# Altium schematic sheet 低电压关断_MAX931.SchDoc
size A4; DocumentNumber: 3; SheetNumber: 3; SheetTotal: 34
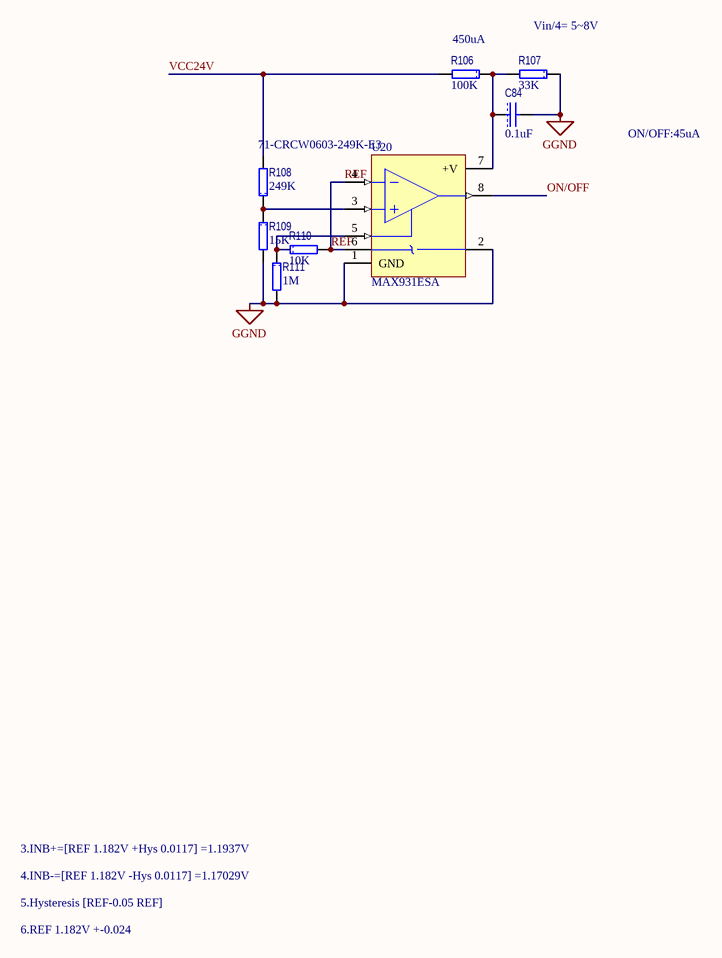
[diagram p0: 低电压关断_MAX931.SchDoc]

## Parts
C84  value 0.1uF  [1608[0603]C]  (hidden comment: C1608X7R1H104K)
R106  value 100K  [1608[0603]R]  (hidden comment: CRCW0603100KFKEA)
R107  value 33K  [1608[0603]R]  (hidden comment: CRCW060333K0FKEA)
R108  value 249K  Supplier Part Number 1: 71-CRCW0603-249K-E3  [1608[0603]R]  (hidden comment: CRCW0603249KFKEA)
R109  value 15K  [1608[0603]R]  (hidden comment: CRCW060315K0FKEA)
R110  value 10K  [1608[0603]R]  (hidden comment: CRCW060310K0FKEA)
R111  value 1M  [1608[0603]R]  (hidden comment: CRCW060310K0FKEA)
U20  MAX931ESA  [NSO8_N]

## Nets
GGND: C84.2 R107.1 R109.2 R111.2 U20.1(GND) U20.2(-V)
ON/OFF: U20.8(OUT)
REF: R110.2 U20.4(IN-) U20.6(REF)
VCC24V: R106.2 R108.2
NetC84_1: C84.1 R106.1 R107.2 U20.7(+V)
NetR108_1: R108.1 R109.1 U20.3(IN+)
NetR110_1: R110.1 R111.1 U20.5(HYST)

## Notes on the sheet
- (near R106) 450uA
- (near R107) Vin/4= 5~8V
- ON/OFF:45uA
- 4.INB-=[REF 1.182V -Hys 0.0117] =1.17029V
- 3.INB+=[REF 1.182V +Hys 0.0117] =1.1937V
- 6.REF 1.182V +-0.024
- 5.Hysteresis [REF-0.05 REF]

## Library data of the parts
C84 = CAP: 多层陶瓷电容器MLCC - SMD/SMT 0603 0.1uF 50volts X7R 10%; Manufacturer: TDK; 尺寸: 0.8 mm W x 1.6 mm L x 0.8 mm H; 工作温度范围: - 55 C to + 125 C; 封装 / 箱体: 0603 (1608 metric); 封装: Reel; 产品: General Type MLCCs; 系列: C; 电压额定值: 50 V; 电容-nF: 100 nF; 电容-pF: 100000 pF; 外壳代码 - in: 0603; 外壳代码 - mm: 1608; 产品种类: Low & Medium Capacitance SMD Ceramic Chip Capacitors; 标准包装数量: 4000; Supplier 1: Mouser; Supplier Part Number 1: 810-C1608X7R1H104K; Manufacturer Part Number: C1608X7R1H104K; RoHS: RoHS Compliant; Description 1: 多层陶瓷电容器MLCC - SMD/SMT 0603 0.1uF 50volts X7R 10%; Category: 多层陶瓷电容器MLCC - SMD/SMT; Stock 1: 224604; Pricing 1: 1=0.160, 50=0.070, 100=0.036, 500=0.019, 1000=0.013, 4000=0.010, 8000=0.009, 12000=0.008, 20000=0.007 (USD); 电容: 0.1 uF; 端接类型: SMD/SMT; 容差: 10 %; 制造商: TDK; 温度系数/代码: X7R; RoHS - 贸泽: Y; Minimum Order Quantity: 1; Reeling: True; ComponentLink1URL: http://www.tdk.com/pdf/general_B11.pdf; ComponentLink1Description: http://www.tdk.com/pdf/general_B11.pdf
R106 = RES: 厚膜电阻器 - SMD 1/10watt 200Kohms 1%
R107 = RES: 厚膜电阻器 - SMD 1/10watt 33Kohms 1%
R108 = RES: 厚膜电阻器 - SMD 1/10watt 249Kohms 1%; Manufacturer: Vishay / Dale; Power Rating: 100 mW; Temperature Coefficient: 100 PPM / K; Voltage Rating: 75 V; Case Height: 0.45 mm; Case Length: 1.55 mm; Case Width: 0.85 mm; Supplier 1: Mouser; Manufacturer Part Number: CRCW0603249KFKEA; RoHS: RoHS Compliant By Exemption; Category: Thick Film Resistors - SMD; Stock 1: 63391; Pricing 1: 1=0.108, 10=0.018, 100=0.014, 1000=0.011, 5000=0.007, 25000=0.005, 50000=0.004 (AUD); Operating Temperature Range: - 55 C to + 155 C; Package / Case: 0603 (1608 metric); Packaging: Reel; Product: Thick Film Resistors SMD; Resistance: 249 kOhms; Series: CRCW; Tolerance: 1 %; Case Code - in: 0603; Case Code - mm: 1608; Product Category: 0603 Thick Film Chip Resistors; Standard Pack Qty: 5000; RoHS - Mouser: E; Minimum Order Quantity: 1; Reeling: True; ComponentLink1URL: http://www.vishay.com/doc?20035; ComponentLink1Description: http://www.vishay.com/doc?20035
R109 = RES: 厚膜电阻器 - SMD 1/10watt 15Kohms 1%; Manufacturer: Vishay / Dale; Power Rating: 100 mW; Temperature Coefficient: 100 PPM / K; Voltage Rating: 75 V; Case Height: 0.45 mm; Case Length: 1.55 mm; Case Width: 0.85 mm; Supplier 1: Mouser; Supplier Part Number 1: 71-CRCW0603-15K-E3; Manufacturer Part Number: CRCW060315K0FKEA; RoHS: RoHS Compliant By Exemption; Category: Thick Film Resistors - SMD; Stock 1: 103280; Pricing 1: 1=0.108, 10=0.018, 100=0.014, 1000=0.011, 5000=0.007, 25000=0.005, 50000=0.004 (AUD); Operating Temperature Range: - 55 C to + 155 C; Package / Case: 0603 (1608 metric); Packaging: Reel; Product: Thick Film Resistors SMD; Resistance: 15 kOhms; Series: CRCW; Tolerance: 1 %; Case Code - in: 0603; Case Code - mm: 1608; Product Category: 0603 Thick Film Chip Resistors; Standard Pack Qty: 5000; RoHS - Mouser: E; Minimum Order Quantity: 1; Reeling: True; ComponentLink1URL: http://www.vishay.com/doc?20035; ComponentLink1Description: http://www.vishay.com/doc?20035
R110 R111 = RES: 厚膜电阻器 - SMD 1/10watt 10Kohms 1%; Manufacturer: Vishay / Dale; 尺寸: 0.85 mm W x 1.55 mm L x 0.45 mm H; 工作温度范围: - 55 C to + 155 C; 封装 / 箱体: 0603 (1608 metric); 封装: Reel; 功率额定值: 100 mW; 产品: Thick Film Resistors SMD; 系列: CRCW; 温度系数: 100 PPM / K; 端接类型: SMD/SMT; 电压额定值: 75 V; 制造商: Vishay; 产品种类: 0603 Thick Film Chip Resistors; 标准包装数量: 5000; 外壳代码 - in: 0603; 外壳代码 - mm: 1608; Supplier 1: Mouser; Supplier Part Number 1: 71-CRCW0603-10K-E3; Manufacturer Part Number: CRCW060310K0FKEA; RoHS: RoHS Compliant By Exemption; Category: 厚膜电阻器 - SMD; Stock 1: 0; Pricing 1: 1=0.080, 10=0.013, 100=0.010, 1000=0.008, 5000=0.005, 25000=0.004, 50000=0.003 (USD); 电阻: 10 kOhms; 容差: 1 %; RoHS - 贸泽: E; Minimum Order Quantity: 1; Reeling: True; ComponentLink1URL: http://www.mouser.com/ds/2/427/dcrcwe3-109170.pdf; ComponentLink1Description: http://www.mouser.com/ds/2/427/dcrcwe3-109170.pdf; Description 1: 厚膜电阻器 - SMD 1/10watt 10Kohms 1%
U20 = MAX931ESA: Ultra Low-Power, Low-Cost Comparator with 2% Reference; Published: 16-Jan-2001; LatestRevisionDate: 13-Apr-2006; LatestRevisionNote: IPC-7351 Footprint Added.; DatasheetVersion: Feb-1997; PackageReference: NSO8; Publisher: Altium Limited; PackageDescription: 8-Pin Small Outline Integrated Circuit 1.27 mm Pitch; Code_JEDEC: MS-012-AA; Code_IPC: SOIC127P600-8; ComponentLink1Description: Manufacturer Link; ComponentLink1URL: http://www.maxim-ic.com/; ComponentLink2Description: Datasheet; ComponentLink2URL: http://pdfserv.maxim-ic.com/en/ds/MAX931-MAX934.pdf